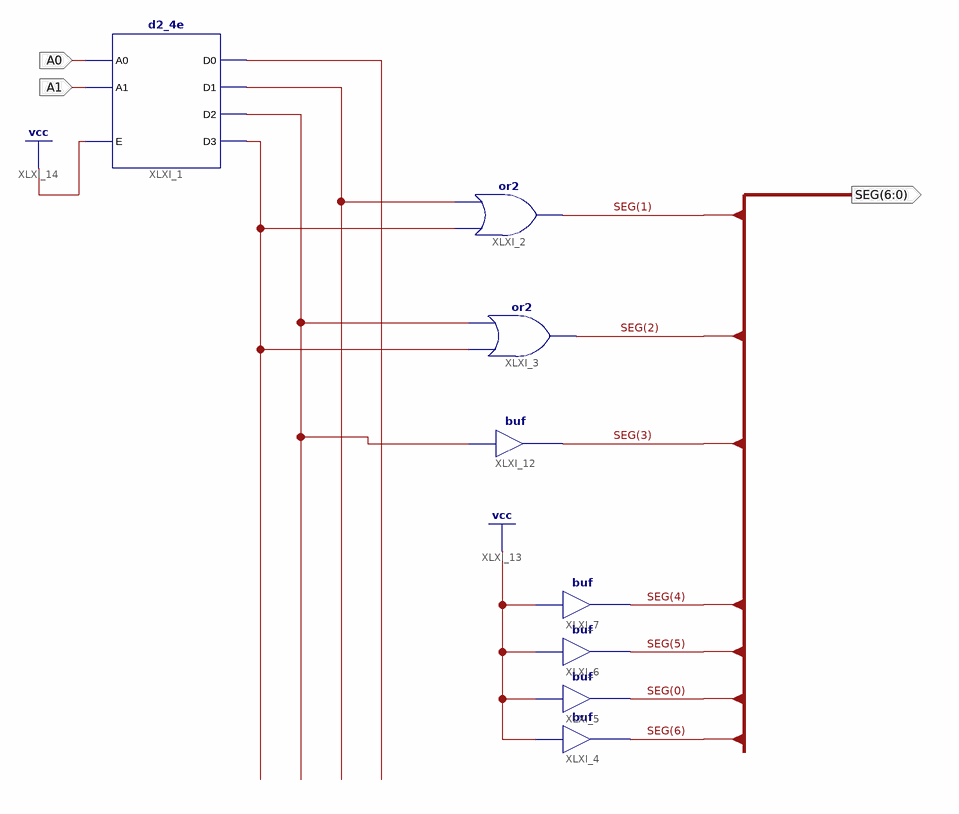
[diagram p0: schematic sheet 1]
// Xilinx ISE schematic FPGA.sch (spartan6) as structural Verilog: 8 symbols, 3 ports
module FPGA (
  input  A0,
  input  A1,
  output [6:0] SEG
);

  wire XLXN_1, XLXN_2, XLXN_3, XLXN_4;

  d2_4e XLXI_1 (.A0(A0), .A1(A1), .E(1'b1), .D0(XLXN_4), .D1(XLXN_3), .D2(XLXN_2), .D3(XLXN_1));
  or XLXI_2 (SEG[1], XLXN_1, XLXN_3);
  or XLXI_3 (SEG[2], XLXN_1, XLXN_2);
  buf XLXI_4 (SEG[6], 1'b1);
  buf XLXI_5 (SEG[0], 1'b1);
  buf XLXI_6 (SEG[5], 1'b1);
  buf XLXI_7 (SEG[4], 1'b1);
  buf XLXI_12 (SEG[3], XLXN_2);
endmodule
